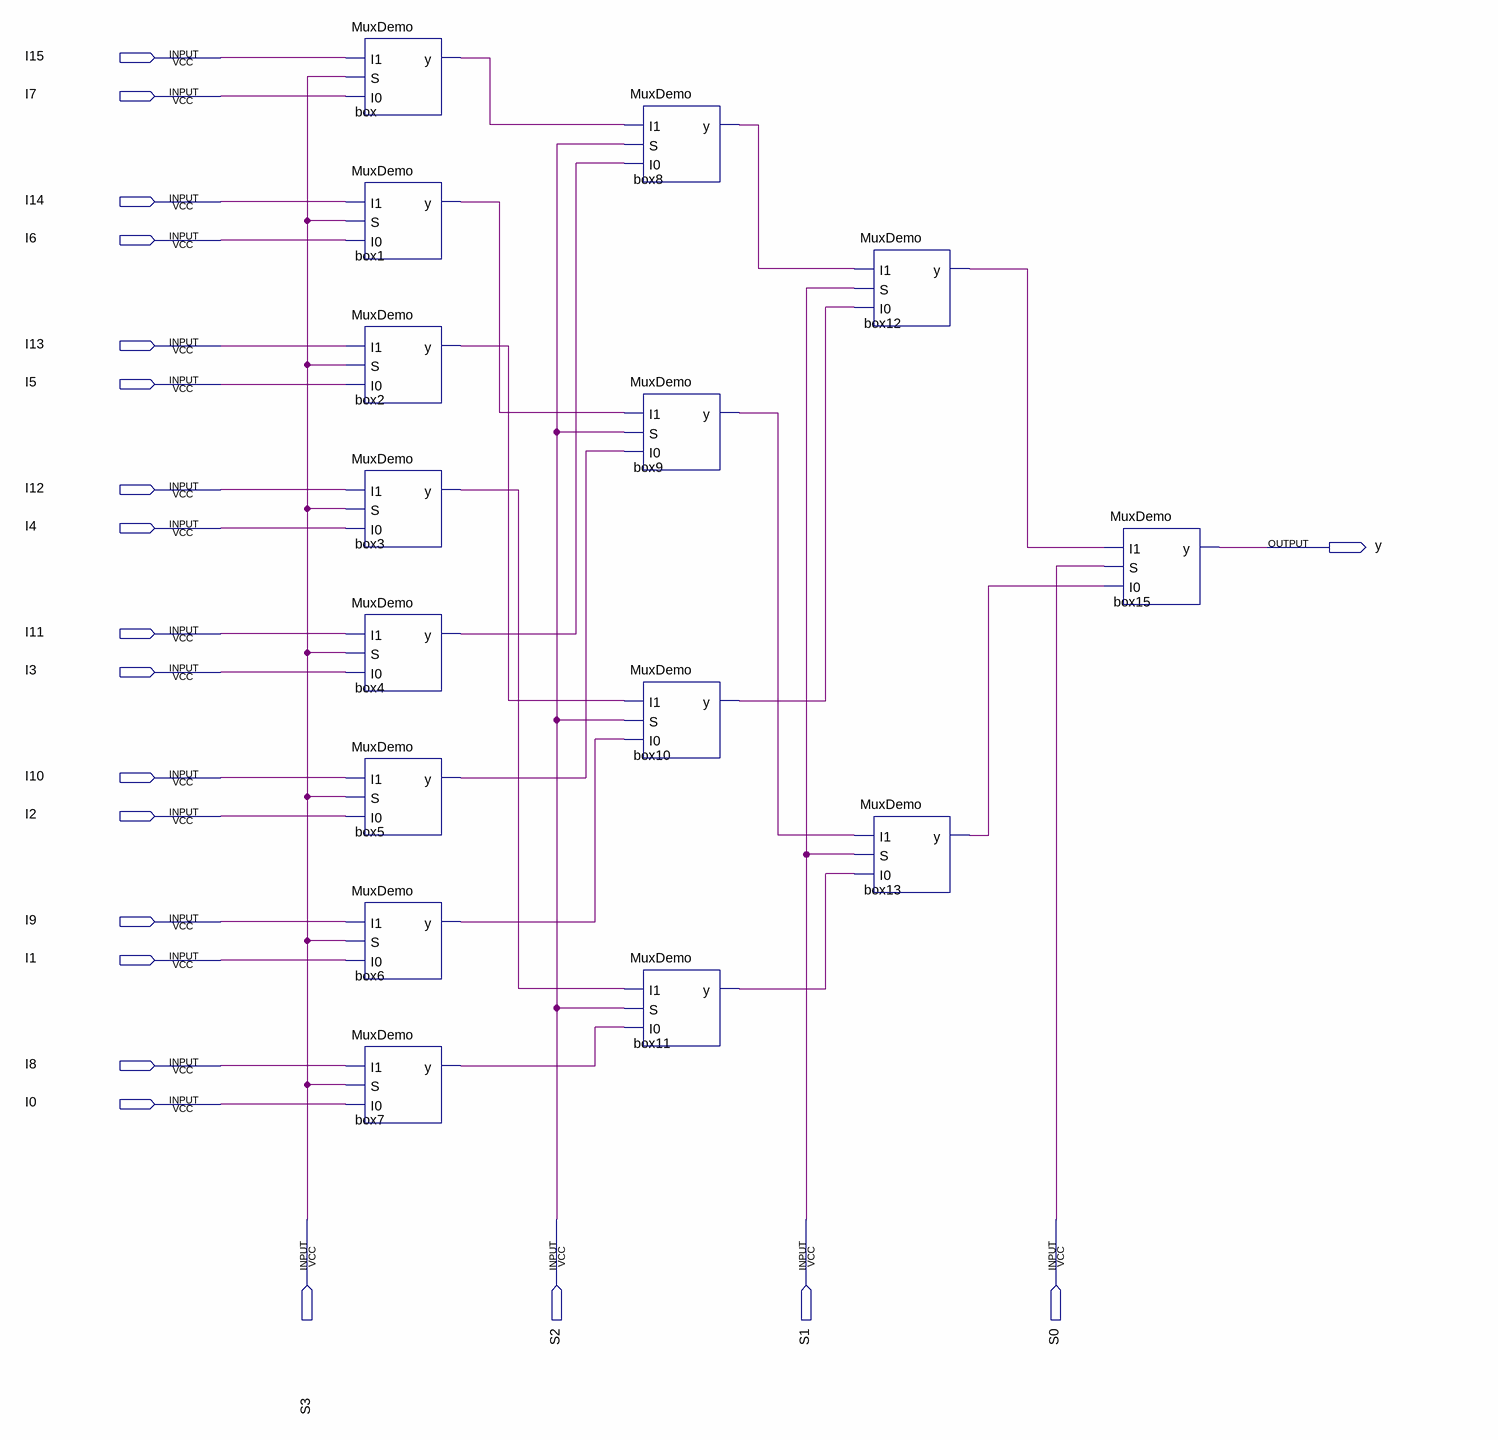
[diagram p0: schematic sheet]
// Quartus schematic Mux16_1.bdf as structural Verilog: 15 symbols, 21 pins
module Mux16_1 (
  input  I15,
  input  I7,
  input  I14,
  input  I6,
  input  I13,
  input  I5,
  input  I12,
  input  I4,
  input  I11,
  input  I3,
  input  I10,
  input  I2,
  input  I9,
  input  I1,
  input  I8,
  input  I0,
  input  S3,
  input  S2,
  input  S1,
  input  S0,
  output y
);

  wire box1_y, box2_y, box3_y, box4_y, box5_y, box6_y, box7_y, box8_y, box9_y, box10_y, box11_y, box12_y,
       box13_y, box_y;

  MuxDemo box (.I1(I15), .S(S3), .I0(I7), .y(box_y));
  MuxDemo box1 (.I1(I14), .S(S3), .I0(I6), .y(box1_y));
  MuxDemo box2 (.I1(I13), .S(S3), .I0(I5), .y(box2_y));
  MuxDemo box3 (.I1(I12), .S(S3), .I0(I4), .y(box3_y));
  MuxDemo box4 (.I1(I11), .S(S3), .I0(I3), .y(box4_y));
  MuxDemo box5 (.I1(I10), .S(S3), .I0(I2), .y(box5_y));
  MuxDemo box6 (.I1(I9), .S(S3), .I0(I1), .y(box6_y));
  MuxDemo box7 (.I1(I8), .S(S3), .I0(I0), .y(box7_y));
  MuxDemo box8 (.I1(box_y), .S(S2), .I0(box4_y), .y(box8_y));
  MuxDemo box9 (.I1(box1_y), .S(S2), .I0(box5_y), .y(box9_y));
  MuxDemo box10 (.I1(box2_y), .S(S2), .I0(box6_y), .y(box10_y));
  MuxDemo box11 (.I1(box3_y), .S(S2), .I0(box7_y), .y(box11_y));
  MuxDemo box12 (.I1(box8_y), .S(S1), .I0(box10_y), .y(box12_y));
  MuxDemo box13 (.I1(box9_y), .S(S1), .I0(box11_y), .y(box13_y));
  MuxDemo box15 (.I1(box12_y), .S(S0), .I0(box13_y), .y(y));
endmodule
